# EasyEDA Pro project ProPrj_DSP BOARD_2026-03-01.epro, board PCB2
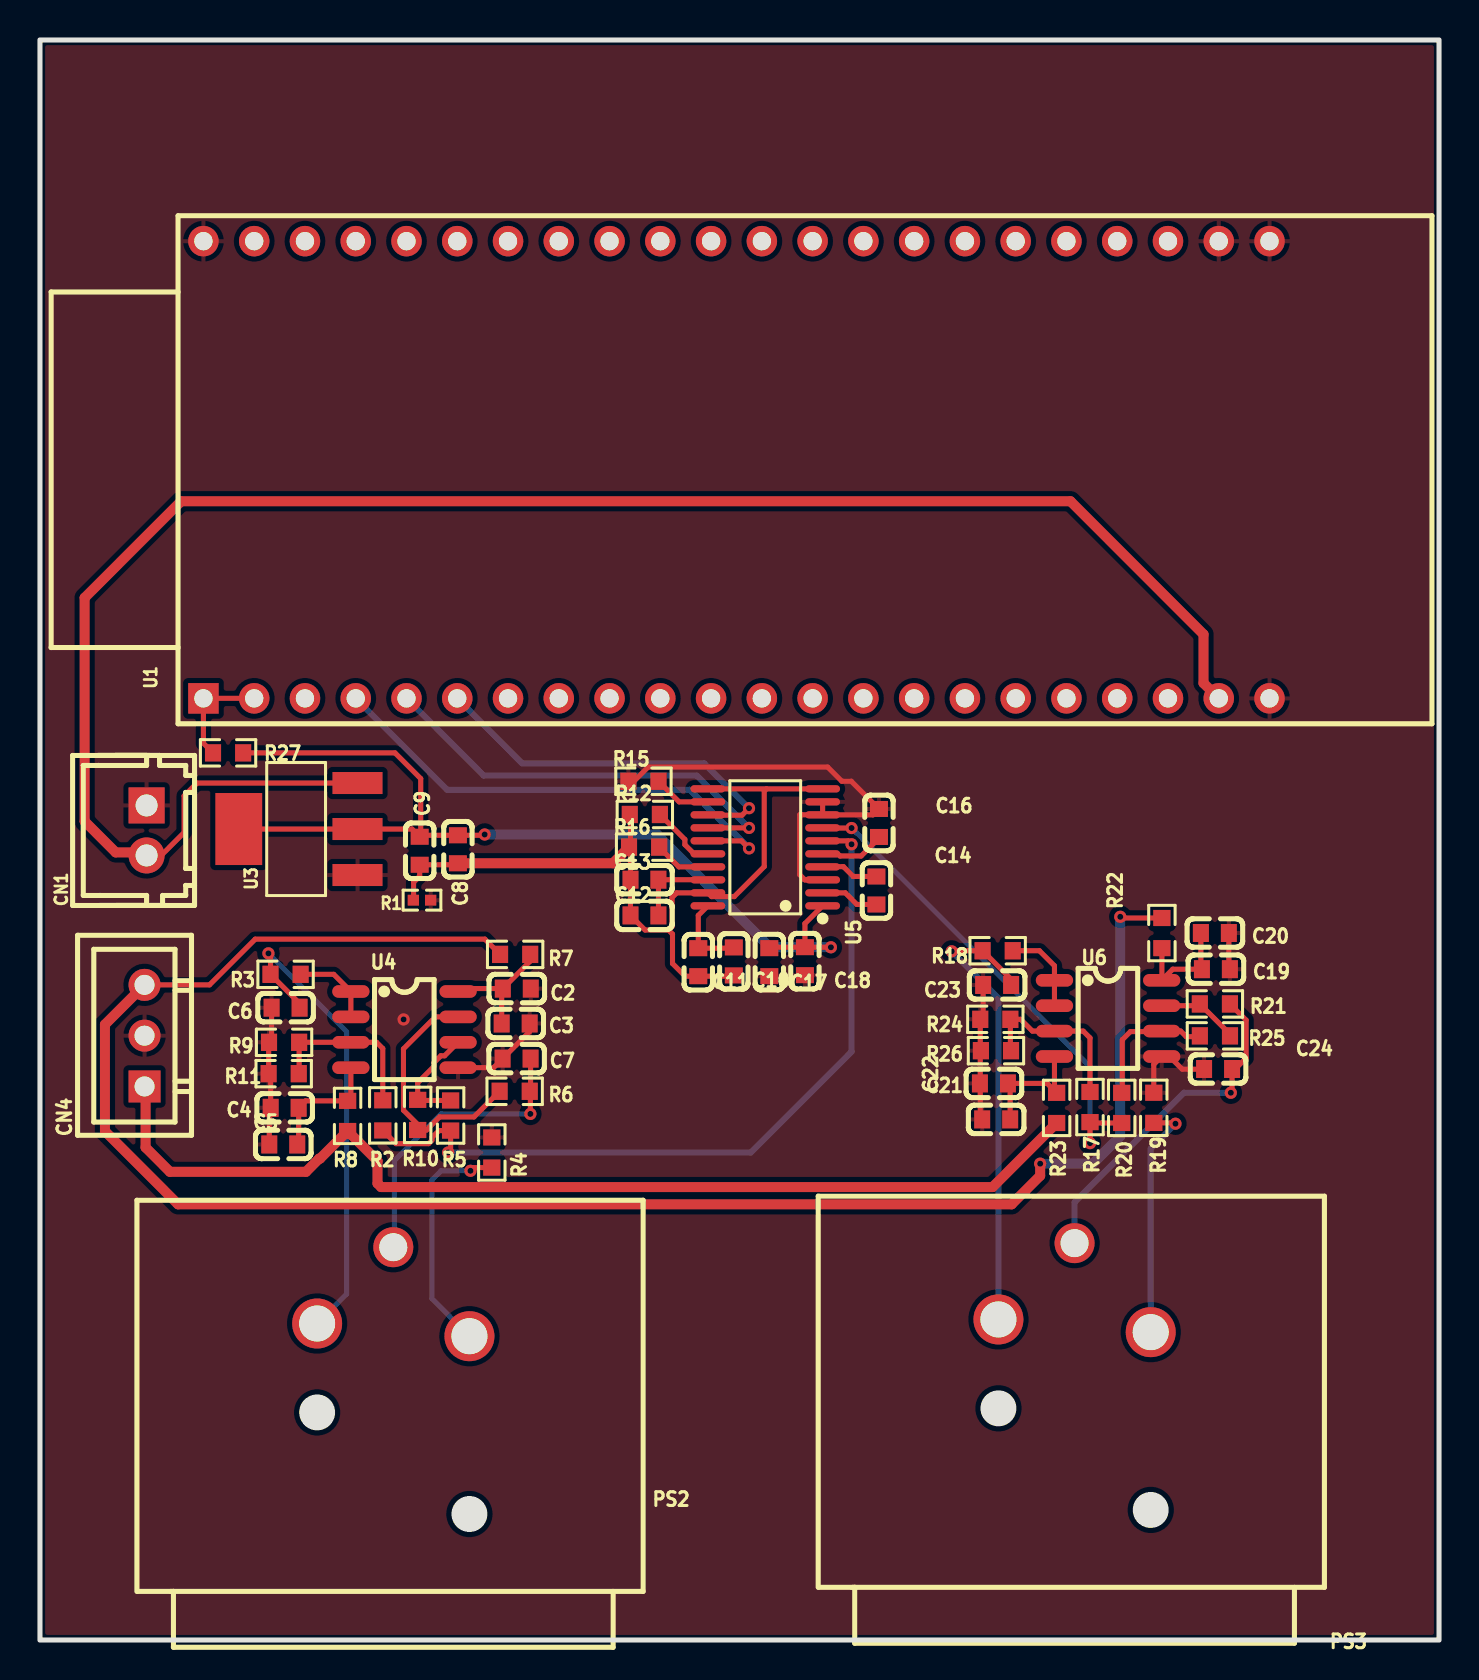
[diagram p4: board, top side]
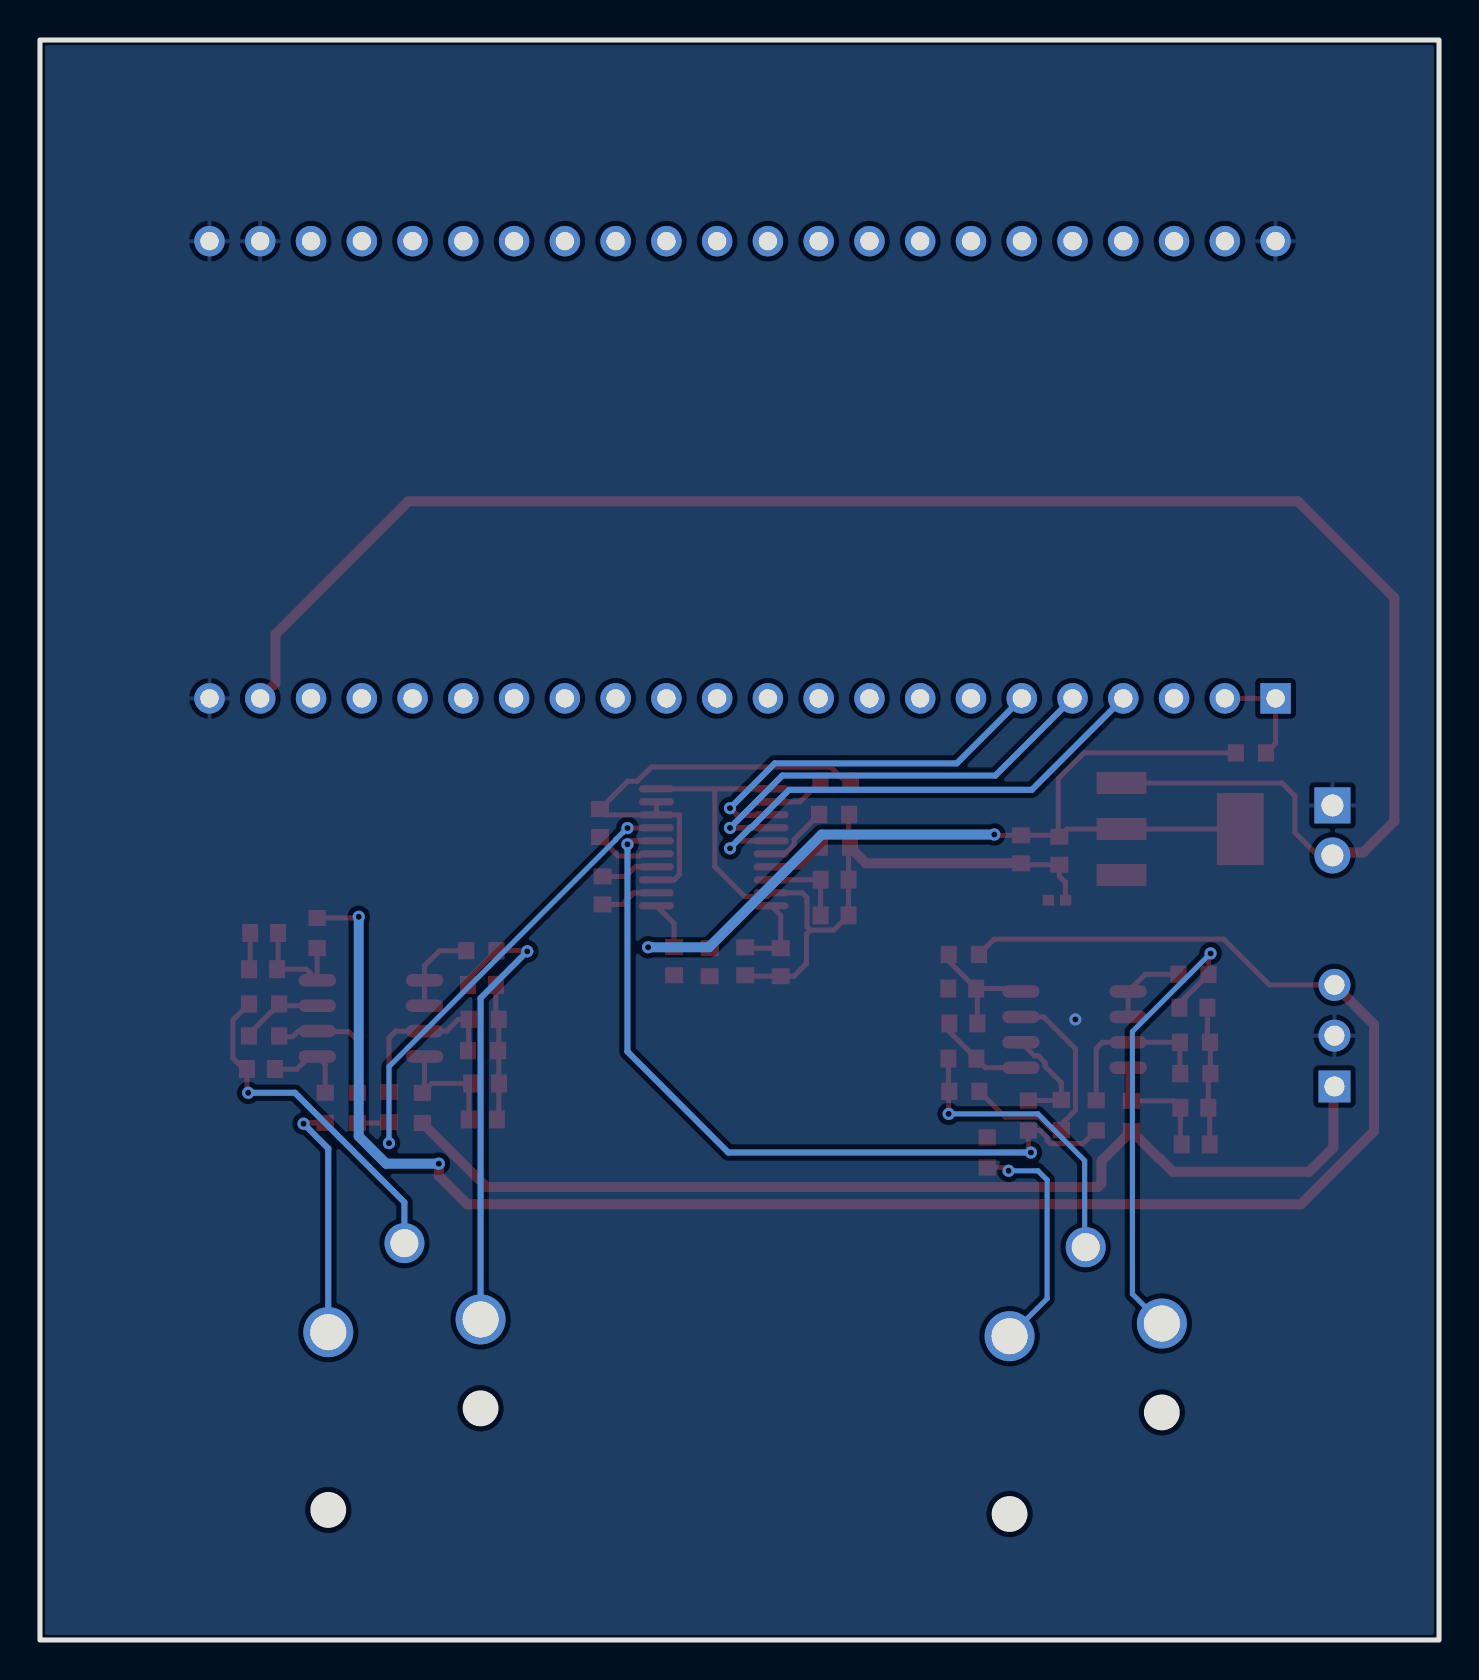
[diagram p5: board, bottom side, seen from below]

Outline 70 x 80 mm; copper layers: Top Layer, Bottom Layer. Coordinates in mm from the lower left corner of the outline.
Outline path: rectangle 0,80 70,0
Stack: Top Layer 0.035mm / Dielectric1 1.51mm FR4 er 4.5 / Bottom Layer 0.035mm

## Design rules (mm)
template: Custom Config
spacing copperThickness1oz: track to track 0.102, other pairs 0.152 to 0.3
spacing copperThickness2oz (default): track to track 0.203, other pairs 0.152 to 0.3
track width copperThickness1oz (default): min 0.127, default 0.254, max 2.54
track width copperThickness2oz: min 0.203, default 0.254, max 2.54
differential pair differentialPair (default): width min 0.127, default 0.254, max 2.54; gap min 0.152, default 0.152
via viaSize (default): diameter min 0.5, default 0.61, max 10; hole min 0.3, default 0.305, max 6.3

## Placement (name value [footprint] x y rotation side)
C2  100nF  [C0603]  23.86 32.57 0 top
C3  10uF  [C0603]  23.8 30.83 0 top
C4  100nF  [C0603]  12.24 26.61 180 top
C5  10uF  [C0603]  12.17 24.78 180 top
C6  220pF  [C0603]  12.29 31.62 0 top
C7  220pF  [C0603]  23.85 29.07 180 top
C8  100nF  [C0603]  20.91 39.54 90 top
C9  47uF  [C0603]  19 39.46 90 top
C10  10uF  [C0603]  34.72 33.93 90 top
C11  100nF  [C0603]  32.94 33.89 90 top
C12  100nF  [C0603]  30.24 36.23 0 top
C13  10uF  [C0603]  30.24 38.02 0 top
C14  2.2uF  [C0603]  41.85 37.48 90 top
C16  2.2uF  [C0603]  41.98 40.85 270 top
C17  100nF  [C0603]  36.49 33.89 90 top
C18  10uF  [C0603]  38.27 33.94 90 top
C19  100nF  [C0603]  58.84 33.54 0 top
C20  10uF  [C0603]  58.79 35.35 0 top
C21  100nF  [C0603]  47.73 27.83 180 top
C22  10uF  [C0603]  47.84 26.03 180 top
C23  220pF  [C0603]  47.89 32.75 0 top
C24  220pF  [C0603]  58.95 28.55 180 top
CN1  ZX-XH2.54-2PZZ  [CONN-TH_2P-P2.50_HX25003-2A]  5.33 40.48 270 top
CN4  ZX-XH2.54-3PZZ  [CONN-TH_3P-P2.54_2501S-3P]  5.23 30.22 90 top
PS2  NC3FAAH-0  [CONN-TH_NC3FAAH-0]  17.68 17.41 180 top
PS3  NC3FAAH-0  [CONN-TH_NC3FAAH-0]  51.77 17.62 180 top
R1  0Ω  [R0402]  19.11 36.99 180 top
R2  10K  [R0603]  17.15 26.23 90 top
R3  100Ω  [R0603]  12.29 33.28 180 top
R4  0  [R0603]  22.61 24.37 270 top
R5  10K  [R0603]  20.55 26.22 90 top
R6  100Ω  [R0603]  23.75 27.43 0 top
R7  2.2Ω  [R0603]  23.77 34.28 180 top
R8  2.2Ω  [R0603]  15.39 26.2 90 top
R9  15K  [R0603]  12.21 29.88 0 top
R10  6.04k  [R0603]  18.9 26.25 270 top
R11  100k  [R0603]  12.19 28.32 0 top
R12  0  [R0603]  30.26 41.28 180 top
R15  0  [R0603]  30.19 42.94 180 top
R16  10K  [R0603]  30.23 39.64 180 top
R17  10K  [R0603]  52.54 26.65 90 top
R18  100Ω  [R0603]  47.92 34.46 180 top
R19  0  [R0603]  55.73 26.61 270 top
R20  10K  [R0603]  54.12 26.6 90 top
R21  100Ω  [R0603]  58.79 31.8 0 top
R22  2.2Ω  [R0603]  56.13 35.35 90 top
R23  2.2Ω  [R0603]  50.87 26.6 90 top
R24  15K  [R0603]  47.8 31.03 0 top
R25  6.04k  [R0603]  58.79 30.21 0 top
R26  100k  [R0603]  47.83 29.47 0 top
R27  0  [R0603]  9.41 44.36 180 top
U1  ESP32-S3-DEVKITC-1-N8  [CONN-TH_ESP32-S3-DEVKITC-1U-N8]  34.85 58.51 90 top
U3  AMS1117-3.3  [SOT-223-3_L6.5-W3.5-P3.05-LS7.0]  12.92 40.55 0 top
U4  NE5532D  [SOP-8_L4.9-W3.9-P1.27-LS6.0-BL]  18.24 30.52 270 top
U5  PCM5102APWR  [TSSOP-20_L6.5-W4.4-P0.65-LS6.4-BL]  36.29 39.63 90 top
U6  NE5532D  [SOP-8_L4.9-W3.9-P1.27-LS6.0-BL]  53.44 31.08 270 top

## Footprints (pads in the part's own frame, mm; a bottom-side part is the same pattern mirrored in y, then rotated)
C0603
  rect 0.8x0.9 smd: 1(-0.7,0) 2(0.7,0)
CONN-TH_2P-P2.50_HX25003-2A
  rect 1.8x1.8 hole 1.1: 1(-1.25,0)
  round 1.8 hole 1.1: 2(1.25,0)
CONN-TH_3P-P2.54_2501S-3P
  rect 1.6x1.6 hole 1: 1(-2.54,0)
  round 1.6 hole 1: 2(0,0) 3(2.54,0)
CONN-TH_ESP32-S3-DEVKITC-1U-N8
  rect 1.524x1.524 hole 0.914: 1(-11.43,26.67)
  round 1.524 hole 0.914: 2(-11.43,24.13) 3(-11.43,21.59) 4(-11.43,19.05) 5(-11.43,16.51) 6(-11.43,13.97) 7(-11.43,11.43) 8(-11.43,8.89) 9(-11.43,6.35) 10(-11.43,3.81) 11(-11.43,1.27) 12(-11.43,-1.27) 13(-11.43,-3.81) 14(-11.43,-6.35) 15(-11.43,-8.89) 16(-11.43,-11.43) 17(-11.43,-13.97) 18(-11.43,-16.51) 19(-11.43,-19.05) 20(-11.43,-21.59) 21(-11.43,-24.13) 22(-11.43,-26.67) 23(11.43,-26.67) 24(11.43,-24.13) 25(11.43,-21.59) 26(11.43,-19.05) 27(11.43,-16.51) 28(11.43,-13.97) 29(11.43,-11.43) 30(11.43,-8.89) 31(11.43,-6.35) 32(11.43,-3.81) 33(11.43,-1.27) 34(11.43,1.27) 35(11.43,3.81) 36(11.43,6.35) 37(11.43,8.89) 38(11.43,11.43) 39(11.43,13.97) 40(11.43,16.51) 41(11.43,19.05) 42(11.43,21.59) 43(11.43,24.13) 44(11.43,26.67)
CONN-TH_NC3FAAH-0
  round 2.5 hole 1.8: 1(-3.81,2.225) 2(3.81,1.59)
  round 2 hole 1.4: 3(0,-2.225)
R0402
  rect 0.566x0.54 smd: 1(-0.433,0) 2(0.433,0)
R0603
  rect 0.806x0.864 smd: 1(-0.753,0) 2(0.753,0)
SOP-8_L4.9-W3.9-P1.27-LS6.0-BL
  oval 0.63x1.865 smd: 1(-1.905,-2.683) 2(-0.635,-2.683) 3(0.635,-2.683) 4(1.905,-2.683) 5(1.905,2.683) 6(0.635,2.683) 7(-0.635,2.683) 8(-1.905,2.683)
SOT-223-3_L6.5-W3.5-P3.05-LS7.0
  rect 2.5x1.1 smd: 1(2.97,-2.3) 2(2.97,0) 3(2.97,2.3)
  rect 2.34x3.6 smd: 4(-2.97,0)
TSSOP-20_L6.5-W4.4-P0.65-LS6.4-BL
  oval 0.364x1.742 smd: 1(-2.925,-2.871) 2(-2.275,-2.871) 3(-1.625,-2.871) 4(-0.975,-2.871) 5(-0.325,-2.871) 6(0.325,-2.871) 7(0.975,-2.871) 8(1.625,-2.871) 9(2.275,-2.871) 10(2.925,-2.871) 11(2.925,2.871) 12(2.275,2.871) 13(1.625,2.871) 14(0.975,2.871) 15(0.325,2.871) 16(-0.325,2.871) 17(-0.975,2.871) 18(-1.625,2.871) 19(-2.275,2.871) 20(-2.925,2.871)

## Nets
As in the schematic.

## Via types
v1: diameter 0.61, hole 0.305, Top Layer to Bottom Layer, 18 vias

## Routing (per net, layer and track width the routed paths; a pad name or vN(x,y) marks a point on that pad's centre or on a via; arc(x,y) is an arc through that point)
3V3: length 5.5
  Top Layer w0.254: R27.2 8.18,44.84 U1.1 U1.2
+5V: length 92.4
  Top Layer w0.254: U3.3 7.86,42.85 7.21,42.2 7.21,40.38 6.06,39.23 CN1.2
  Top Layer w0.5: CN1.2 5.18,39.38 3.79,39.38 2.23,40.93 2.23,52.11 7.06,56.94 51.56,56.94 58.22,50.28 58.22,47.84 U1.21
AGND: length 47.4
  Top Layer w0.254: R19.1 55.73,28.78 U6.5 56.52,29.17 57.15,28.54 58.23,28.54 C24.2 ; U5.8 41.68,41.26 C16.1 40.59,42.94 40.12,42.94 39.41,43.65 30.43,43.65 29.72,42.94 R15.2 ; U5.8 U5.9 ; U5.8 39.16,41.26 38.01,41.26 38.01,38.27 38.27,38.01 U5.3 ; C20.2 59.48,33.59 C19.2 ; C22.2 47.05,26.12 R24.1 47.19,31.18 C23.1 ; C6.1 11.59,30.01 R9.1 11.44,29.87 R11.1 11.54,28.22 C4.2 11.47,26.54 C5.2 ; U4.5 22.69,28.62 C7.2 24.5,30.42 C3.2
  vias: v1(18.19,31.03)
GND: length 41.9
  Top Layer w0.254: R1.2 18.69,37 18.69,37.89 19,38.19 C9.1 20.84,38.76 C8.1 ; R12.2 29.55,41.24 C13.1 C12.1 30.27,35.5 31.44,35.5 ; C10.1 34.67,33.19 C11.1 32.28,33.19 31.65,33.82 31.65,35.29 31.44,35.5 ; 31.44,35.5 31.46,35.5 31.62,35.66 31.62,37.12 31.86,37.36 U5.19 33.61,37.17 34.74,37.17 36.24,38.67 36.24,42.45 36.35,42.56 ; 36.35,42.56 U5.10 ; 36.35,42.56 U5.11
  Top Layer w0.5: C8.1 28.67,38.84 R16.2
3D3: length 50
  Top Layer w0.254: U5.1 38.27,35.82 C18.2 ; C18.2 39.57,34.64 v1(39.57,34.64) ; C18.2 36.54,34.64 C17.2 ; R27.1 17.76,44.36 19.05,43.07 19.05,40.21 ; 19.05,40.21 C9.2 18.61,40.55 U3.2 U3.4 ; 19.05,40.21 19.07,40.24 C8.2 22.21,40.24 v1(22.25,40.27)
  Bottom Layer w0.5: v1(39.57,34.64) 36.52,34.64 30.89,40.27 v1(22.25,40.27)
+15: length 94.3
  Top Layer w0.254: v1(54.05,36.16) 54.11,36.1 R22.2 ; CN4.3 8.48,32.76 10.77,35.04 22.26,35.04 R7.2
  Top Layer w0.5: CN4.3 3.25,30.77 3.25,25.44 6.91,21.78 48.62,21.78 50.04,23.21 v1(50.04,23.82)
  Bottom Layer w0.5: v1(54.05,36.16) 54.05,25.19 52.68,23.82 v1(50.04,23.82)
++V: length 5.7
  Top Layer w0.254: 56.13,32.99 56.68,33.54 C19.1 58.08,33.59 C20.1 ; 56.13,32.99 U6.8 ; 56.13,32.99 R22.1
+V: length 6.3
  Top Layer w0.254: C2.1 24.53,33.94 R7.1 ; C2.1 23.1,32.52 C3.1 ; C2.1 21.07,32.57 U4.8
-15: length 53.2
  Top Layer w0.5: CN4.1 5.28,27.63 5.28,24.63 6.5,23.41 13.31,23.41 13.97,24.07 14.01,24.07 R8.1 16.89,23.95 16.89,22.83 17.07,22.65 47.66,22.65 50.87,25.85
--V: length 6.2
  Top Layer w0.254: 50.76,27.46 50.39,27.83 C21.1 48.54,27.72 C22.1 ; 50.76,27.46 R23.2 ; 50.76,27.46 U6.4
-V: length 6.2
  Top Layer w0.254: U4.4 15.55,27.12 R8.2 13.29,26.96 C4.1 12.94,24.85 C5.1
DAC_L: length 39.3
  Top Layer w0.254: R2.1 17.81,24.82 19.45,24.82 19.61,24.98 19.61,25.12 19.96,25.47 R5.1 20.55,24.5 v1(20.42,24.37) ; U5.6 40.43,39.96 v1(40.61,39.79)
  Bottom Layer w0.305: v1(40.61,39.79) 40.61,29.42 35.56,24.37 v1(20.42,24.37)
DAC_R: length 24.8
  Top Layer w0.254: v1(40.61,40.6) 39.17,40.6 U5.7 ; v1(52.54,24.84) R17.1 52.58,25.85 R20.1
  Bottom Layer w0.254: v1(52.54,24.84) 52.54,28.67 41.19,40.01 41.19,40.03 40.85,40.37 40.84,40.37 v1(40.61,40.6)
GPI04: length 25
  Top Layer w0.254: v1(35.48,39.58) 35.1,39.96 U5.15
  Bottom Layer w0.305: v1(35.48,39.58) 35.48,39.6 34.45,40.63 34.4,40.63 32.52,42.51 20.37,42.51 U1.4
GPI05: length 21.9
  Top Layer w0.254: U5.14 35.47,40.61 v1(35.48,40.6)
  Bottom Layer w0.305: v1(35.48,40.6) 32.86,43.22 22.2,43.22 U1.5
GPI06: length 19.1
  Top Layer w0.254: U5.13 33.44,41.24 35.13,41.24 v1(35.48,41.59)
  Bottom Layer w0.305: U1.6 24.13,43.83 33.23,43.83 v1(35.48,41.59)
MUTE: length 2.8
  Top Layer w0.254: U5.17 31.96,38.66 R16.1
XLR_OUT1_PIN1: length 11.8
  Top Layer w0.254: R4.2 21.7,23.62 v1(21.54,23.46)
  Bottom Layer w0.254: v1(21.54,23.46) 20.07,23.46 19.61,23 19.61,17.07 PS2.1
XLR_OUT1_PIN2: length 24.1
  Top Layer w0.254: C6.2 12.99,31.83 R3.2 11.53,34.23 v1(11.43,34.33)
  Bottom Layer w0.254: PS2.2 15.34,17.3 15.34,30.42 v1(11.43,34.33)
XLR_OUT1_PIN3: length 14.9
  Top Layer w0.254: C7.1 24.55,27.48 R6.2 24.54,27.4 v1(24.54,26.3)
  Bottom Layer w0.254: v1(24.54,26.3) 20.07,26.3 17.73,23.97 17.73,19.69 PS2.3
XLR_OUT2_PIN1: length 12
  Top Layer w0.254: R19.2 56.77,25.86 v1(56.81,25.81)
  Bottom Layer w0.305: v1(56.81,25.81) 55.58,24.58 PS3.1
XLR_OUT2_PIN2: length 23.2
  Top Layer w0.254: v1(45.62,34.43) 45.65,34.46 R18.2 48.59,33.04 C23.2
  Bottom Layer w0.305: v1(45.62,34.43) 47.95,32.1 PS3.2
XLR_OUT2_PIN3: length 17.3
  Top Layer w0.254: v1(59.58,27.36) 59.65,27.42 C24.1 59.8,28.55 60.35,29.1 60.35,30.99 R21.2
  Bottom Layer w0.305: v1(59.58,27.36) 57.24,27.36 51.77,21.88 PS3.3
$1N13090: length 4.1
  Top Layer w0.254: U4.2 U4.1 14.7,33.28 R3.1
$1N33160: length 8.5
  Top Layer w0.254: R2.2 17.15,29.57 16.84,29.89 U4.3 12.97,29.89 R9.2 12.97,28.34 R11.2
$1N35156: length 5.5
  Top Layer w0.254: U4.6 20.24,29.21 20.06,29.21 19.71,28.86 19.71,28.67 18.9,27.86 R10.1 18.93,26.98 R5.2
$1N35160: length 12.6
  Top Layer w0.254: U4.7 19.79,31.16 18.19,29.56 18.19,26.49 18.9,25.78 R10.2 19.34,25.5 20,26.15 21.72,26.15 R6.1
$1N35428: length 4.1
  Top Layer w0.254: U5.20 32.94,36.23 C11.2 34.67,34.59 C10.2
$1N35634: length 4.3
  Top Layer w0.254: U5.18 33.41,38.02 C13.2 C12.2
$1N35671: length 3.4
  Top Layer w0.254: R12.1 32.27,40.03 32.27,39.77 32.73,39.31 U5.16
$1N35875: length 2.9
  Top Layer w0.254: R15.1 31.98,41.91 U5.12
$1N35928: length 2.9
  Top Layer w0.254: C14.1 40.87,36.78 40.29,37.36 U5.2
$1N35932: length 2.9
  Top Layer w0.254: C14.2 40.69,38.18 40.2,38.67 39.17,38.67 U5.4
$1N36160: length 3.3
  Top Layer w0.254: U5.5 39.92,39.31 40.02,39.2 41.09,39.2 41.98,40.09 C16.2
$1N37272: length 6.9
  Top Layer w0.254: 58.03,30.21 57.99,30.17 57.35,30.17 57.07,30.44 U6.6 56.1,30.42 54.56,30.42 54.15,30.01 54.15,27.39 R20.2
$1N37276: length 4.2
  Top Layer w0.254: R25.2 59.54,30.29 R21.1 57.94,31.71 U6.7
$1N37285: length 8.7
  Top Layer w0.254: R26.2 48.55,29.5 R24.2 49.07,31.03 49.66,30.44 U6.3 52.2,30.44 52.54,30.1 R17.2
$1N37312: length 4.4
  Top Layer w0.254: U6.2 U6.1 50.76,33.71 50.01,34.46 R18.1

## Copper pours and planes (outline as drawn; the poured copper is in the pictures)
AGND on Top Layer: -1.78,81.68 72.85,81.68 72.85,-2.4 -1.78,-2.4
AGND on Bottom Layer: -0.71,80.61 71.22,80.61 71.22,-1.18 -0.71,-1.18
